# EAGLE schematic freesoc_sparkfun (EAGLE 7.1.0)

## Sheet 1 of 3
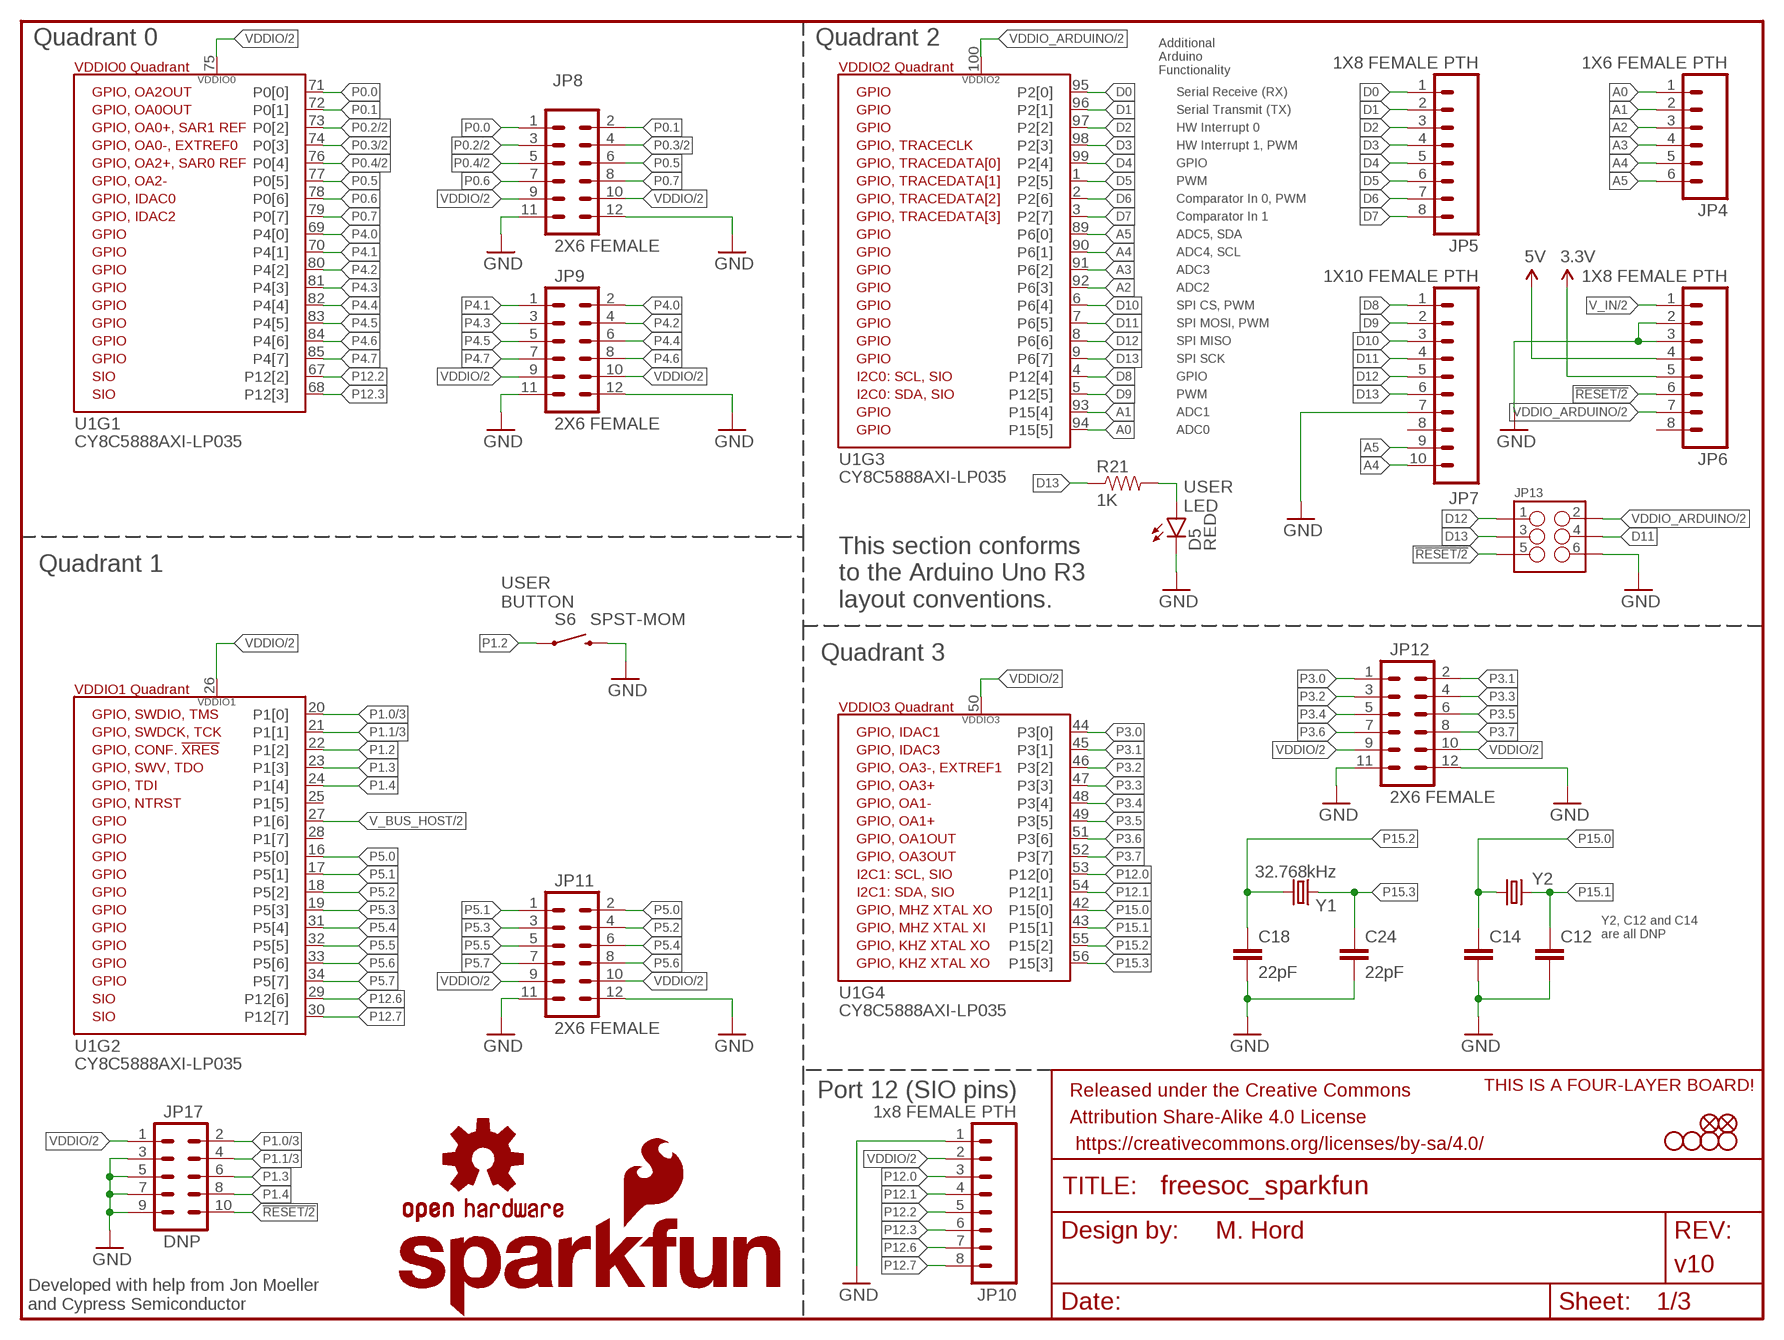
[diagram p0: schematic, sheet 1]

### Parts
C12  CAPPTH  [CAP-PTH-SMALL]
C14  CAPPTH  [CAP-PTH-SMALL]
C18  22pF  22PF-50V-5%(0603)  [0603-CAP]
C24  22pF  22PF-50V-5%(0603)  [0603-CAP]
D5  RED  LED-RED0603  [LED-0603]
FID1  FIDUCIAL1X2  [FIDUCIAL-1X2]
FID2  FIDUCIAL1X2  [FIDUCIAL-1X2]
FRAME1  FRAME-LETTER  [CREATIVE_COMMONS]
JP4  1X6 FEMALE PTH  M06SILK_FEMALE_PTH  [1X06]
JP5  1X8 FEMALE PTH  M08SILK_FEMALE_PTH  [1X08]
JP6  1X8 FEMALE PTH  M08SILK_FEMALE_PTH  [1X08]
JP7  1X10 FEMALE PTH  M10SILK_FEMALE_PTH  [1X10]
JP8  2X6 FEMALE  M06X2PTH_FEMALE  [2X6]
JP9  2X6 FEMALE  M06X2PTH_FEMALE  [2X6]
JP10  1x8 FEMALE PTH  M08SILK_FEMALE_PTH  [1X08]
JP11  2X6 FEMALE  M06X2PTH_FEMALE  [2X6]
JP12  2X6 FEMALE  M06X2PTH_FEMALE  [2X6]
JP13  M03X22X3_SILK_MALE_PTH  [2X3]
JP17  DNP  M05X20.05_IN_PTH_SILK  [2X5_PTH_SILK_.05]
LOGO1  SFE_LOGO_NAME_FLAME.2_INCH  [SFE_LOGO_NAME_FLAME_.2]
LOGO2  OSHW-LOGOS  [OSHW-LOGO-S]
R21  1K  1KOHM1/10W1%(0603)  [0603-RES]
S6  SPST-MOM  SWITCH-MOMENTARY-2SMD  [TACTILE-SWITCH-SMD]
STANDOFF1  STAND-OFF  [STAND-OFF]
STANDOFF2  STAND-OFF  [STAND-OFF]
STANDOFF3  STAND-OFF  [STAND-OFF]
STANDOFF4  STAND-OFF  [STAND-OFF]
U1  CY8C5888AXI-LP035  PSOC_5LP_100QFP  [TQFP-100-14X14MM]
U$1  FOUR_LAYER_WARNING  [FOUR_LAYER_WARNING]
Y1  32.768kHz  CRYSTALTC26H  [TC26H]
Y2  CRYSTALHC49US  [HC49US]

### Nets
3.3V: JP6.5 ; also sheet 2,3
5V: JP6.4 ; also sheet 2,3
!RESET: JP6.6 JP13.5 JP17.10 ; also sheet 2,3
A0: JP4.1 U1.94(P15[5])
A1: JP4.2 U1.93(P15[4])
A2: JP4.3 U1.92(P6[3])
A3: JP4.4 U1.91(P6[2])
A4: JP4.5 JP7.10 U1.90(P6[1])
A5: JP4.6 JP7.9 U1.89(P6[0])
D0: JP5.1 U1.95(P2[0])
D1: JP5.2 U1.96(P2[1])
D2: JP5.3 U1.97(P2[2])
D3: JP5.4 U1.98(P2[3])
D4: JP5.5 U1.99(P2[4])
D5: JP5.6 U1.1(P2[5])
D6: JP5.7 U1.2(P2[6])
D7: JP5.8 U1.3(P2[7])
D8: JP7.1 U1.4(P12[4])
D9: JP7.2 U1.5(P12[5])
D10: JP7.3 U1.6(P6[4])
D11: JP7.4 JP13.4 U1.7(P6[5])
D12: JP7.5 JP13.1 U1.8(P6[6])
D13: JP7.6 JP13.3 R21.1 U1.9(P6[7])
GND: C12.2 C14.2 C18.2 C24.2 D5.C JP6.2 JP6.3 JP7.7 JP8.11 JP8.12 JP9.11 JP9.12 JP10.1 JP11.11 JP11.12 JP12.11 JP12.12 JP13.6 JP17.3 JP17.5 JP17.7 JP17.9 S6.3 ; also sheet 2,3
N$26: D5.A R21.2
P0.0: JP8.1 U1.71(P0[0])
P0.1: JP8.2 U1.72(P0[1])
P0.2: JP8.3 U1.73(P0[2]) ; also sheet 2
P0.3: JP8.4 U1.74(P0[3]) ; also sheet 2
P0.4: JP8.5 U1.76(P0[4]) ; also sheet 2
P0.5: JP8.6 U1.77(P0[5])
P0.6: JP8.7 U1.78(P0[6])
P0.7: JP8.8 U1.79(P0[7])
P1.0: JP17.2 U1.20(P1[0]) ; also sheet 3
P1.1: JP17.4 U1.21(P1[1]) ; also sheet 3
P1.2: S6.1 U1.22(P1[2])
P1.3: JP17.6 U1.23(P1[3])
P1.4: JP17.8 U1.24(P1[4])
P3.0: JP12.1 U1.44(P3[0])
P3.1: JP12.2 U1.45(P3[1])
P3.2: JP12.3 U1.46(P3[2])
P3.3: JP12.4 U1.47(P3[3])
P3.4: JP12.5 U1.48(P3[4])
P3.5: JP12.6 U1.49(P3[5])
P3.6: JP12.7 U1.51(P3[6])
P3.7: JP12.8 U1.52(P3[7])
P4.0: JP9.2 U1.69(P4[0])
P4.1: JP9.1 U1.70(P4[1])
P4.2: JP9.4 U1.80(P4[2])
P4.3: JP9.3 U1.81(P4[3])
P4.4: JP9.6 U1.82(P4[4])
P4.5: JP9.5 U1.83(P4[5])
P4.6: JP9.8 U1.84(P4[6])
P4.7: JP9.7 U1.85(P4[7])
P5.0: JP11.2 U1.16(P5[0])
P5.1: JP11.1 U1.17(P5[1])
P5.2: JP11.4 U1.18(P5[2])
P5.3: JP11.3 U1.19(P5[3])
P5.4: JP11.6 U1.31(P5[4])
P5.5: JP11.5 U1.32(P5[5])
P5.6: JP11.8 U1.33(P5[6])
P5.7: JP11.7 U1.34(P5[7])
P12.0: JP10.3 U1.53(P12[0])
P12.1: JP10.4 U1.54(P12[1])
P12.2: JP10.5 U1.67(P12[2])
P12.3: JP10.6 U1.68(P12[3])
P12.6: JP10.7 U1.29(P12[6])
P12.7: JP10.8 U1.30(P12[7])
P15.0: C14.1 U1.42(P15[0]) Y2.1
P15.1: C12.1 U1.43(P15[1]) Y2.2
P15.2: C18.1 U1.55(P15[2]) Y1.2
P15.3: C24.1 U1.56(P15[3]) Y1.1
V_BUS_HOST: U1.27(P1[6]) ; also sheet 2
V_IN: JP6.1 ; also sheet 2
VDDIO: JP8.9 JP8.10 JP9.9 JP9.10 JP10.2 JP11.9 JP11.10 JP12.9 JP12.10 JP17.1 U1.26(VDDIO1) U1.50(VDDIO3) U1.75(VDDIO0) ; also sheet 2,3
VDDIO_ARDUINO [ARDUINO_VCC]: JP6.7 JP13.2 U1.100(VDDIO2) ; also sheet 2
Unconnected: JP6.8 JP7.8 U1.25(P1[5]) U1.28(P1[7])

### Notes on the sheet
- Quadrant 0 | Quadrant 2
- Additional
  Arduino
  Functionality
- Serial Receive (RX)
- Serial Transmit (TX)
- HW Interrupt 0
- HW Interrupt 1, PWM
- GPIO
- PWM
- Comparator In 0, PWM
- Comparator In 1
- ADC5, SDA
- ADC4, SCL
- ADC3
- ADC2
- SPI CS, PWM
- SPI MOSI, PWM
- SPI MISO
- SPI SCK
- GPIO
- PWM
- ADC1
- ADC0
- USER
  LED
- Quadrant 1
- USER
  BUTTON
- This section conforms
  to the Arduino Uno R3
  layout conventions.
- Quadrant 3
- Y2, C12 and C14
  are all DNP
- Port 12 (SIO pins)
- Developed with help from Jon Moeller
  and Cypress Semiconductor

## Sheet 2 of 3
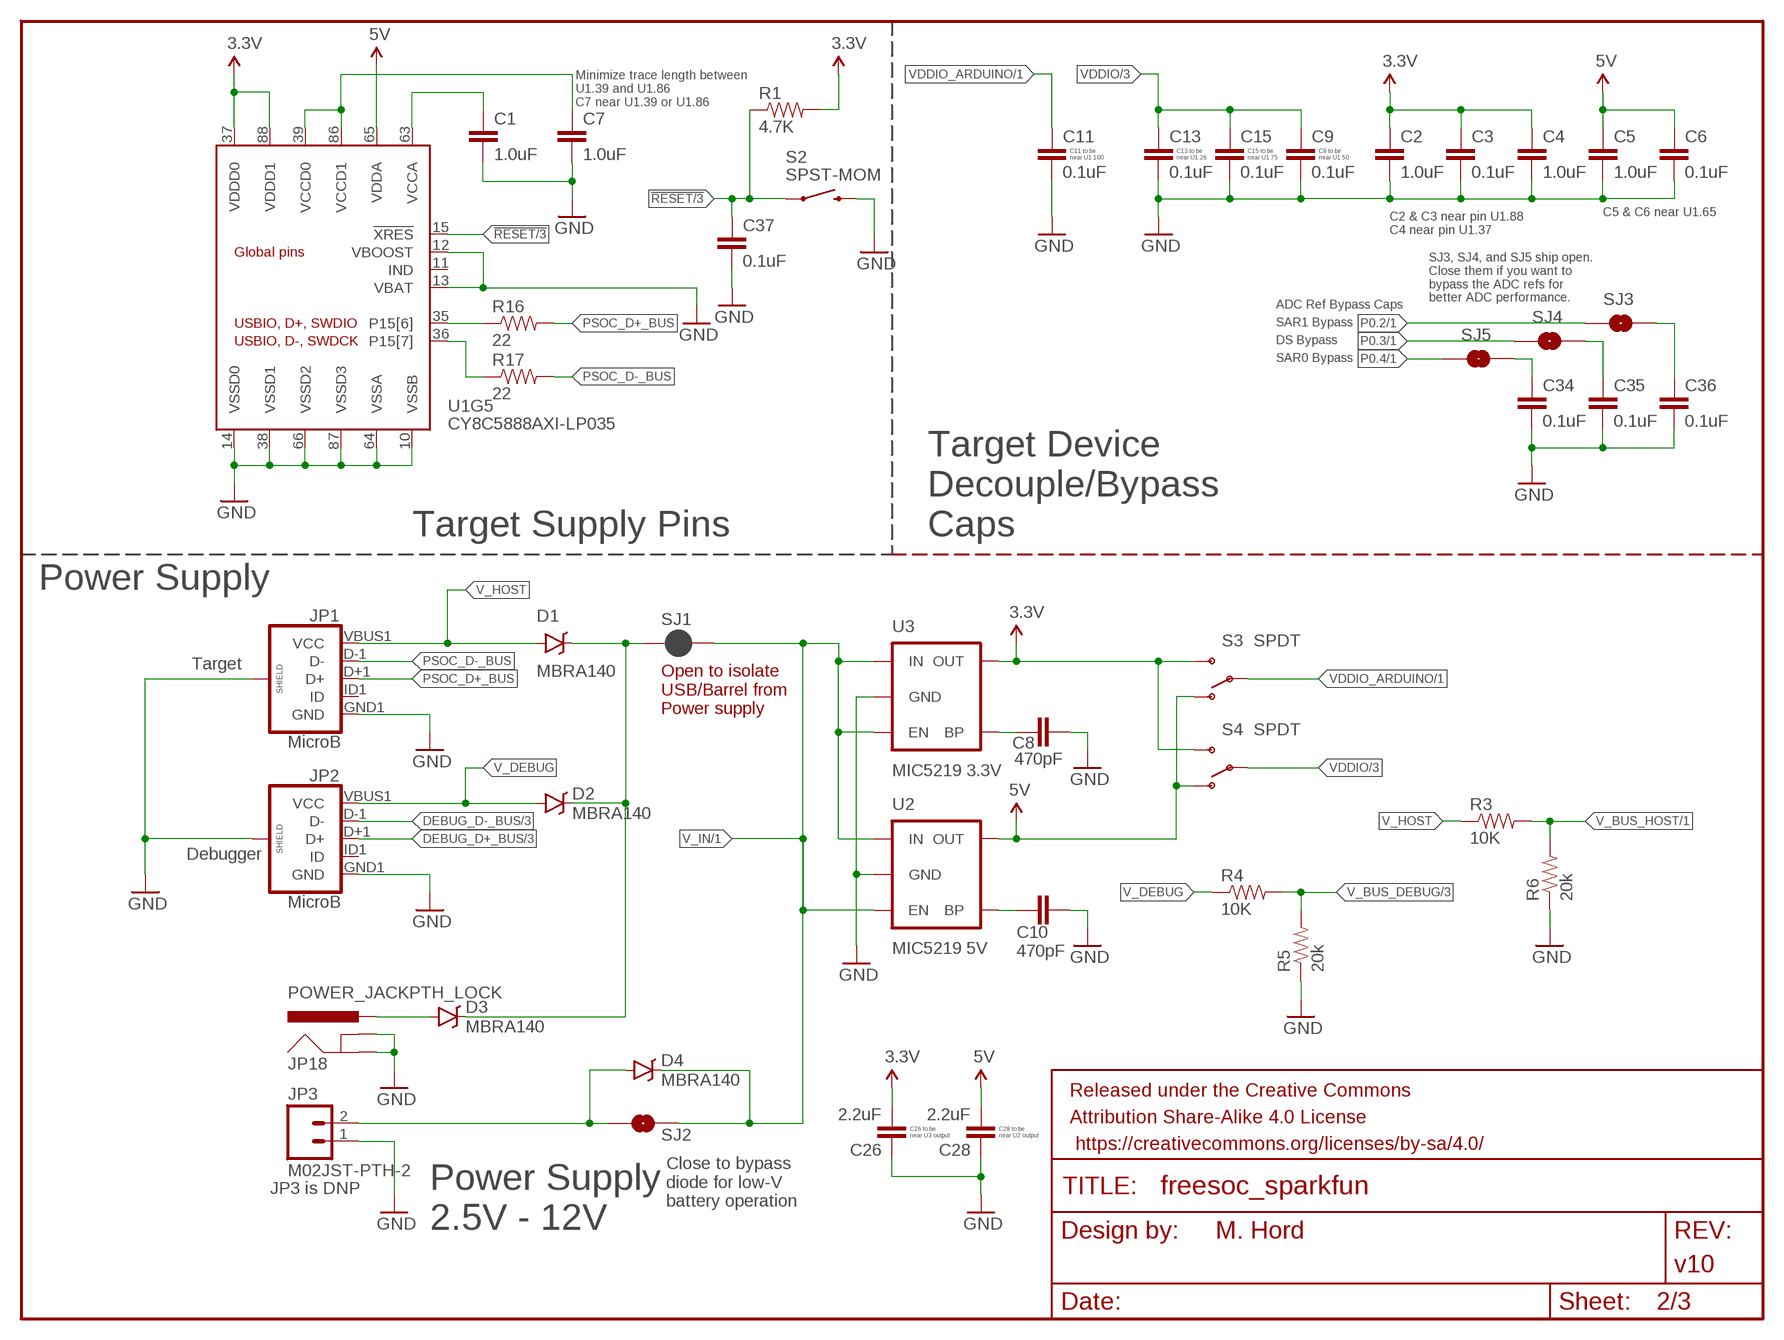
[diagram p1: schematic, sheet 2]

### Parts
C1  1.0uF  1.0UF-16V-10%(0402)  [0402-CAP]
C2  1.0uF  1.0UF-16V-10%(0402)  [0402-CAP]
C3  0.1uF  0.1UF-16V(+-10%)(0402)  [0402-CAP]
C4  1.0uF  1.0UF-16V-10%(0402)  [0402-CAP]
C5  1.0uF  1.0UF-16V-10%(0402)  [0402-CAP]
C6  0.1uF  0.1UF-16V(+-10%)(0402)  [0402-CAP]
C7  1.0uF  1.0UF-16V-10%(0402)  [0402-CAP]
C8  470pF  470PF-50V-5%(0603)SMD  [0603-CAP]
C9  0.1uF  0.1UF-16V(+-10%)(0402)  [0402-CAP]
C10  470pF  470PF-50V-5%(0603)SMD  [0603-CAP]
C11  0.1uF  0.1UF-16V(+-10%)(0402)  [0402-CAP]
C13  0.1uF  0.1UF-16V(+-10%)(0402)  [0402-CAP]
C15  0.1uF  0.1UF-16V(+-10%)(0402)  [0402-CAP]
C26  2.2uF  2.2UF-10V-20%(0603)  [0603-CAP]
C28  2.2uF  2.2UF-10V-20%(0603)  [0603-CAP]
C34  0.1uF  0.1UF-16V(+-10%)(0402)  [0402-CAP]
C35  0.1uF  0.1UF-16V(+-10%)(0402)  [0402-CAP]
C36  0.1uF  0.1UF-16V(+-10%)(0402)  [0402-CAP]
C37  0.1uF  0.1UF-16V(+-10%)(0402)  [0402-CAP]
D1  MBRA140  [SMA-DIODE]
D2  MBRA140  [SMA-DIODE]
D3  MBRA140  [SMA-DIODE]
D4  MBRA140  [SMA-DIODE]
FRAME2  FRAME-LETTER  [CREATIVE_COMMONS]
JP1  MicroB  USB_MICROB_PLUGCONN-11752  [USB-B-MICRO-SMD_V03]
JP2  MicroB  USB_MICROB_PLUGCONN-11752  [USB-B-MICRO-SMD_V03]
JP3  M02JST-PTH-2  [JST-2-PTH]
JP18  POWER_JACKPTH_LOCK  [POWER_JACK_PTH_LOCK]
R1  4.7K  4.7KOHM-1/10W-1%(0603)  [0603-RES]
R3  10K  10KOHM-1/10W-1%(0603)0603  [0603-RES]
R4  10K  10KOHM-1/10W-1%(0603)0603  [0603-RES]
R5  20k  20KOHM1/10W1%(0603)  [0603-RES]
R6  20k  20KOHM1/10W1%(0603)  [0603-RES]
R16  22  22OHM1/10W1%(0402)  [0402-RES]
R17  22  22OHM1/10W1%(0402)  [0402-RES]
S2  SPST-MOM  SWITCH-MOMENTARY-2SMD  [TACTILE-SWITCH-SMD]
S3  SPDT  SWITCH-SPDTPTH_LOCK  [SWITCH-SPDT_LOCK.007S]
S4  SPDT  SWITCH-SPDTPTH_LOCK  [SWITCH-SPDT_LOCK.007S]
SJ1  JUMPER-PAD-2-NC_BY_PASTE  [PAD-JUMPER-2-NC_BY_PASTE_YES_SILK]
SJ2  JUMPER-PAD-2-NOYES_SILK  [PAD-JUMPER-2-NO_YES_SILK]
SJ3  JUMPER-PAD-2-NO  [PAD-JUMPER-2-NO_NO_SILK]
SJ4  JUMPER-PAD-2-NO  [PAD-JUMPER-2-NO_NO_SILK]
SJ5  JUMPER-PAD-2-NO  [PAD-JUMPER-2-NO_NO_SILK]
U2  MIC5219 5V  V_REG_MIC52195V  [SOT23-5]
U3  MIC5219 3.3V  V_REG_MIC52193.3V  [SOT23-5]

### Nets
3.3V: C2.1 C3.1 C4.1 C26.2 R1.2 S3.3(S) S4.3(S) U1.37(VDDD0) U1.88(VDDD1) U3.5(OUT) ; also sheet 1,3
5V: C5.1 C6.1 C28.2 S3.1(O) S4.1(O) U1.65(VDDA) U2.5(OUT) ; also sheet 1,3
!RESET: C37.1 R1.1 S2.1 U1.15(!XRES) ; also sheet 1,3
DEBUG_D+_BUS: JP2.D+1(D+) ; also sheet 3
DEBUG_D-_BUS: JP2.D-1(D-) ; also sheet 3
GND: C1.2 C2.2 C3.2 C4.2 C5.2 C6.2 C7.2 C8.2 C9.2 C10.2 C11.2 C13.2 C15.2 C26.1 C28.1 C34.2 C35.2 C36.2 C37.2 JP1.GND1(GND) JP1.SHIELD1(SHIELD) JP1.SHIELD2(SHIELD) JP1.SHIELD3(SHIELD) JP2.GND1(GND) JP2.SHIELD1(SHIELD) JP2.SHIELD2(SHIELD) JP2.SHIELD3(SHIELD) JP3.1 JP18.GND JP18.GNDBREAK R5.1 R6.1 S2.3 U1.10(VSSB) U1.12(VBOOST) U1.13(VBAT) U1.14(VSSD0) U1.38(VSSD1) U1.64(VSSA) U1.66(VSSD2) U1.87(VSSD3) U2.2(GND) U3.2(GND) ; also sheet 1,3
N$1: C8.1 U3.4(BP)
N$2: C10.1 U2.4(BP)
N$3: C34.1 SJ5.2
N$4: C35.1 SJ4.2
N$5: C36.1 SJ3.2
N$13: D3.A JP18.PWR
N$16: D1.C D2.C D3.C SJ1.1
N$17: D4.A JP3.2 SJ2.1
P0.2: SJ3.1 ; also sheet 1
P0.3: SJ4.1 ; also sheet 1
P0.4: SJ5.1 ; also sheet 1
PSOC_D+_BUS: JP1.D+1(D+) R16.2
PSOC_D+_PAD: R16.1 U1.35(P15[6])
PSOC_D-_BUS: JP1.D-1(D-) R17.2
PSOC_D-_PAD: R17.1 U1.36(P15[7])
V_BUS_DEBUG: R4.2 R5.2 ; also sheet 3
V_BUS_HOST: R3.2 R6.2 ; also sheet 1
V_DEBUG: D2.A JP2.VBUS1(VCC) R4.1
V_HOST: D1.A JP1.VBUS1(VCC) R3.1
V_IN: D4.C SJ1.2 SJ2.2 U2.1(IN) U2.3(EN) U3.1(IN) U3.3(EN) ; also sheet 1
VCCA: C1.1 U1.63(VCCA)
VCCD: C7.1 U1.39(VCCD0) U1.86(VCCD1)
VDDIO: C9.1 C13.1 C15.1 S4.2(P) ; also sheet 1,3
VDDIO_ARDUINO [ARDUINO_VCC]: C11.1 S3.2(P) ; also sheet 1
Unconnected: JP1.ID1(ID) JP2.ID1(ID) U1.11(IND)

### Notes on the sheet
- Minimize trace length between
  U1.39 and U1.86
  C7 near U1.39 or U1.86
- C11 to be 
  near U1.100
- C13 to be 
  near U1.26
- C15 to be 
  near U1.75
- C9 to be 
  near U1.50
- C5 & C6 near U1.65
- C2 & C3 near pin U1.88
  C4 near pin U1.37
- SJ3, SJ4, and SJ5 ship open.
  Close them if you want to
  bypass the ADC refs for
  better ADC performance.
- ADC Ref Bypass Caps
- SAR1 Bypass
- DS Bypass
- SAR0 Bypass
- Target Supply Pins
- Target Device
  Decouple/Bypass
  Caps
- Power Supply
- Target
- Open to isolate
  USB/Barrel from
  Power supply
- Debugger
- C26 to be 
  near U3 output
- C28 to be 
  near U2 output
- JP3 is DNP
- Close to bypass
  diode for low-V
  battery operation
- Power Supply
  2.5V - 12V

## Sheet 3 of 3
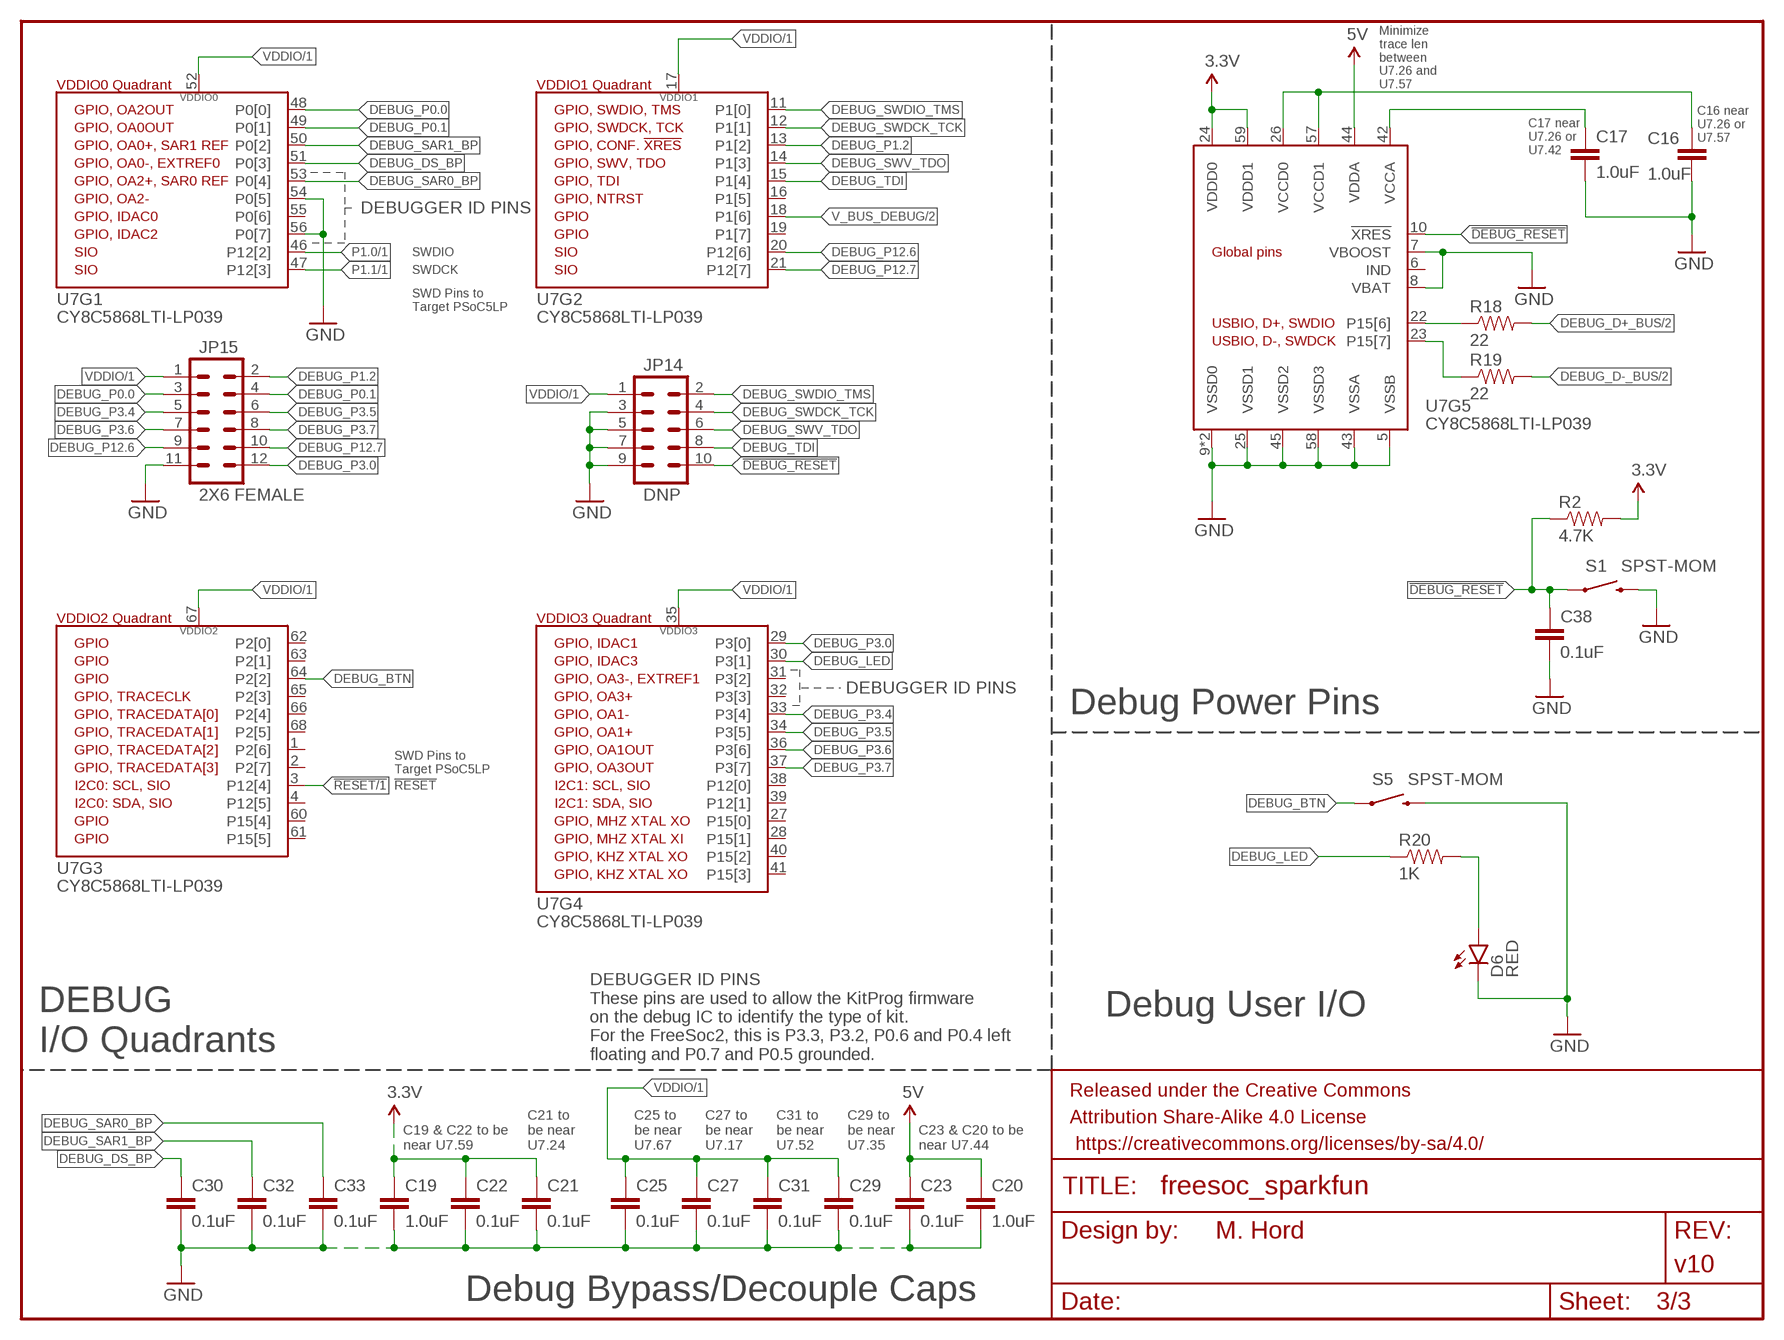
[diagram p2: schematic, sheet 3]

### Parts
C16  1.0uF  1.0UF-16V-10%(0402)  [0402-CAP]
C17  1.0uF  1.0UF-16V-10%(0402)  [0402-CAP]
C19  1.0uF  1.0UF-16V-10%(0402)  [0402-CAP]
C20  1.0uF  1.0UF-16V-10%(0402)  [0402-CAP]
C21  0.1uF  0.1UF-16V(+-10%)(0402)  [0402-CAP]
C22  0.1uF  0.1UF-16V(+-10%)(0402)  [0402-CAP]
C23  0.1uF  0.1UF-16V(+-10%)(0402)  [0402-CAP]
C25  0.1uF  0.1UF-16V(+-10%)(0402)  [0402-CAP]
C27  0.1uF  0.1UF-16V(+-10%)(0402)  [0402-CAP]
C29  0.1uF  0.1UF-16V(+-10%)(0402)  [0402-CAP]
C30  0.1uF  0.1UF-16V(+-10%)(0402)  [0402-CAP]
C31  0.1uF  0.1UF-16V(+-10%)(0402)  [0402-CAP]
C32  0.1uF  0.1UF-16V(+-10%)(0402)  [0402-CAP]
C33  0.1uF  0.1UF-16V(+-10%)(0402)  [0402-CAP]
C38  0.1uF  0.1UF-16V(+-10%)(0402)  [0402-CAP]
D6  RED  LED-RED0603  [LED-0603]
FRAME3  FRAME-LETTER  [CREATIVE_COMMONS]
JP14  DNP  M05X20.05_IN_PTH_SILK  [2X5_PTH_SILK_.05]
JP15  2X6 FEMALE  M06X2PTH_FEMALE  [2X6]
R2  4.7K  4.7KOHM-1/10W-1%(0603)  [0603-RES]
R18  22  22OHM1/10W1%(0402)  [0402-RES]
R19  22  22OHM1/10W1%(0402)  [0402-RES]
R20  1K  1KOHM1/10W1%(0603)  [0603-RES]
S1  SPST-MOM  SWITCH-MOMENTARY-2SMD  [TACTILE-SWITCH-SMD]
S5  SPST-MOM  SWITCH-MOMENTARY-2SMD  [TACTILE-SWITCH-SMD]
U7  CY8C5868LTI-LP039  PSOC_5LP_68QFN  [QFN-68]

### Nets
3.3V: C19.1 C21.1 C22.1 R2.2 U7.24(VDDD0) U7.59(VDDD1) ; also sheet 1,2
5V: C20.1 C23.1 U7.44(VDDA) ; also sheet 1,2
!DEBUG_RESET: C38.1 JP14.10 R2.1 S1.1 U7.10(!XRES)
!RESET: U7.3(P12[4]) ; also sheet 1,2
DEBUG_BTN: S5.1 U7.64(P2[2])
DEBUG_D+_BUS: R18.2 ; also sheet 2
DEBUG_D+_PAD: R18.1 U7.22(P15[6])
DEBUG_D-_BUS: R19.2 ; also sheet 2
DEBUG_D-_PAD: R19.1 U7.23(P15[7])
DEBUG_DS_BP: C30.1 U7.51(P0[3])
DEBUG_LED: R20.1 U7.30(P3[1])
DEBUG_P0.0: JP15.3 U7.48(P0[0])
DEBUG_P0.1: JP15.4 U7.49(P0[1])
DEBUG_P1.2: JP15.2 U7.13(P1[2])
DEBUG_P3.0: JP15.12 U7.29(P3[0])
DEBUG_P3.4: JP15.5 U7.33(P3[4])
DEBUG_P3.5: JP15.6 U7.34(P3[5])
DEBUG_P3.6: JP15.7 U7.36(P3[6])
DEBUG_P3.7: JP15.8 U7.37(P3[7])
DEBUG_P12.6: JP15.9 U7.20(P12[6])
DEBUG_P12.7: JP15.10 U7.21(P12[7])
DEBUG_SAR0_BP: C33.1 U7.53(P0[4])
DEBUG_SAR1_BP: C32.1 U7.50(P0[2])
DEBUG_SWDCK_TCK: JP14.4 U7.12(P1[1])
DEBUG_SWDIO_TMS: JP14.2 U7.11(P1[0])
DEBUG_SWV_TDO: JP14.6 U7.14(P1[3])
DEBUG_TDI: JP14.8 U7.15(P1[4])
GND: C16.2 C17.2 C19.2 C20.2 C21.2 C22.2 C23.2 C25.2 C27.2 C29.2 C30.2 C31.2 C32.2 C33.2 C38.2 D6.C JP14.3 JP14.5 JP14.7 JP14.9 JP15.11 S1.3 S5.3 U7.5(VSSB) U7.7(VBOOST) U7.8(VBAT) U7.9(VSSD0) U7.25(VSSD1) U7.43(VSSA) U7.45(VSSD2) U7.54(P0[5]) U7.56(P0[7]) U7.58(VSSD3) U7.69(VSSD0) ; also sheet 1,2
N$14: C16.1 U7.26(VCCD0) U7.57(VCCD1)
N$23: D6.A R20.2
N$27: C17.1 U7.42(VCCA)
P1.0: U7.46(P12[2]) ; also sheet 1
P1.1: U7.47(P12[3]) ; also sheet 1
V_BUS_DEBUG: U7.18(P1[6]) ; also sheet 2
VDDIO: C25.1 C27.1 C29.1 C31.1 JP14.1 JP15.1 U7.17(VDDIO1) U7.35(VDDIO3) U7.52(VDDIO0) U7.67(VDDIO2) ; also sheet 1,2
Unconnected: U7.1(P2[6]) U7.2(P2[7]) U7.4(P12[5]) U7.6(IND) U7.16(P1[5]) U7.19(P1[7]) U7.27(P15[0]) U7.28(P15[1]) U7.31(P3[2]) U7.32(P3[3]) U7.38(P12[0]) U7.39(P12[1]) U7.40(P15[2]) U7.41(P15[3]) U7.55(P0[6]) U7.60(P15[4]) U7.61(P15[5]) U7.62(P2[0]) U7.63(P2[1]) U7.65(P2[3]) U7.66(P2[4]) U7.68(P2[5])

### Notes on the sheet
- Minimize
  trace len
  between
  U7.26 and
  U7.57
- C16 near 
  U7.26 or
  U7.57
- C17 near 
  U7.26 or
  U7.42
- DEBUGGER ID PINS
- SWDIO
- SWDCK
- SWD Pins to 
  Target PSoC5LP
- DEBUGGER ID PINS
- Debug Power Pins
- SWD Pins to 
  Target PSoC5LP
- !RESET
- DEBUGGER ID PINS
  These pins are used to allow the KitProg firmware
  on the debug IC to identify the type of kit. 
  For the FreeSoc2, this is P3.3, P3.2, P0.6 and P0.4 left
  floating and P0.7 and P0.5 grounded.
- Debug User I/O
- DEBUG
  I/O Quadrants
- C19 & C22 to be
  near U7.59
- C21 to
  be near
  U7.24
- C25 to
  be near
  U7.67
- C27 to
  be near
  U7.17
- C31 to
  be near
  U7.52
- C29 to
  be near
  U7.35
- C23 & C20 to be
  near U7.44
- Debug Bypass/Decouple Caps

## Library data of the parts
C1 C2 C4 C5 C7 C16 C17 C19 C20 = SparkFun-Capacitors:1.0UF-16V-10%(0402); PROD_ID: CAP-12417
C3 C6 C9 C11 C13 C15 C21-C23 C25 C27 C29-C38 = SparkFun-Capacitors:0.1UF-16V(+-10%)(0402); PROD_ID: CAP-12416
C8 C10 = SparkFun-Capacitors:470PF-50V-5%(0603): CAP-07884; PROD_ID: CAP-07884
C12 C14 = SparkFun-Capacitors:CAP: Capacitor Standard 0603 ceramic capacitor, and 0.1" leaded capacitor.
C18 C24 = SparkFun-Capacitors:22PF-50V-5%(0603): CAP-07876; PROD_ID: CAP-07876
C26 C28 = SparkFun-Capacitors:2.2UF-10V-20%(0603): CAP-07888; PROD_ID: CAP-07888
D1-D4 = SparkFun-DiscreteSemi:MBRA140: 40V, 1A Schottky rectifier SMA/DO-214AC package DIO-08053; PROD_ID: DIO-08053
D5 D6 = SparkFun-LED:LED-RED: Assorted Red LEDs LilyPad 1206- DIO-09912 1206- DIO-00809 0603- DIO-00819; PROD_ID: DIO-00819
FID1 FID2 = SparkFun-Aesthetics:FIDUCIAL: Fiducial Alignment Points Various fiducial points for machine vision alignment.
FRAME1-FRAME3 = SparkFun-Aesthetics:FRAME-LETTER: Schematic Frame Standard 8.5x11 US Letter frame; DESIGNER: M. Hord; VERSION: v10
JP1 JP2 = SparkFun-Connectors:USB_MICROB_PLUG: USB Micro-B connectors Some male, some female. Watch your step!; PROD_ID: CONN-11752
JP3 = SparkFun-Connectors:M02: Standard 2-pin 0.1" header. Use with - straight break away headers ( PRT-00116) - right angle break away headers (PRT-00553) - swiss pins (PRT-00743) - machine pins (PRT-00117) - female headers (PRT-00115) Molex polarized connector foot print use with: PRT-08233 with associated crimp pins and housings. 2.54_SCREWTERM for use with PRT-10571. 3.5mm Screw Terminal footprints for PRT-08084 5mm Screw Terminal footprints for use with PRT-08432; PROD_ID: CONN-09863; SKU: PRT-09914
JP4 = SparkFun-Connectors:M06: Header 6 Standard 6-pin 0.1" header. Use with straight break away headers (SKU : PRT-00116), right angle break away headers (PRT-00553), swiss pins (PRT-00743), machine pins (PRT-00117), and female headers (PRT-00115). Molex polarized connector foot print use with SKU : PRT-08094 with associated crimp pins and housings. NOTES ON THE VARIANTS LOCK and LOCK_LONGPADS... This footprint was designed to help hold the alignment of a through-hole component (i.e. 6-pin header) while soldering it into place. You may notice that each hole has been shifted either up or down by 0.005 of an inch from it's more standard position (which is a perfectly straight line). This slight alteration caused the pins (the squares in the middle) to touch the edges of the holes. Because they are alternating, it causes a "brace" to hold the component in place. 0.005 has proven to be the perfect amount of "off-center" position when using our standard breakaway headers. Although looks a little odd when you look at the bare footprint, once you have a header in there, the alteration is very hard to notice. Also,if you push a header all the way into place, it is covered up entirely on the bottom side. This idea of altering the position of holes to aid alignment will be further integrated into the Sparkfun Library for other footprints. It can help hold any component with 3 or more connection pins.; PROD_ID: CONN-08437
JP5 JP6 JP10 = SparkFun-Connectors:M08: Header 8 Standard 8-pin 0.1" header. Use with straight break away headers (SKU : PRT-00116), right angle break away headers (PRT-00553), swiss pins (PRT-00743), machine pins (PRT-00117), and female headers (PRT-00115).; PROD_ID: CONN-08438
JP7 = SparkFun-Connectors:M10: Header 10 Standard 10-pin 0.1" header. Use with straight break away headers (SKU : PRT-00116), right angle break away headers (PRT-00553), swiss pins (PRT-00743), machine pins (PRT-00117), and female headers (PRT-00115).; PROD_ID: CONN-11563
JP8 JP9 JP11 JP12 JP15 = SparkFun-Connectors:M06X2; PROD_ID: CONN-12423
JP13 = SparkFun-Connectors:M03X2: 2x3 .1" header. Shrouded, with keying- CONN-10681 SMT- CONN-11415 Pogo pins- HW-11044; PROD_ID: CONN-09701
JP14 JP17 = SparkFun-Connectors:M05X2: Header 5x2 Standard 10-pin dual row 0.1" header. Commonly used with AVR-ISP. Use with Spark Fun Electronics SKU: PRT-00778
JP18 = SparkFun-Connectors:POWER_JACK: Power Jack This is the standard 5.5mm barrel jack for power. The PTH is the most common, proven, reliable, footprint. The Slot footprint only works if the mill layer is transmitted to the PCB fab house so be warned. Mating wall wart : TOL-00298 (and others); PROD_ID: CONN-08197; SF_ID: PRT-00119
LOGO1 = SparkFun-Aesthetics:SFE_LOGO_NAME_FLAME: SFE Logo, name and flame This is the SparkFun full logo. The logo on the schematic will always be the same size; the package variant is the height of the flame part of the logo. Default layer for the logo on the board is tSilk.
LOGO2 = SparkFun-Aesthetics:OSHW-LOGO: Open Source Hardware Logo This logo indicates the piece of hardware it is found on incorporates a OSHW license and/or adheres to the definition of open source hardware found here: http://freedomdefined.org/OSHW
R1 R2 = SparkFun-Resistors:4.7KOHM-1/10W-1%(0603): RES-07857; PROD_ID: RES-07857
R3 R4 = SparkFun-Resistors:10KOHM-1/10W-1%(0603): RES-00824; PROD_ID: RES-00824
R5 R6 = SparkFun-Resistors:20KOHM1/10W1%(0603): RES-09383; PROD_ID: RES-09383
R16-R19 = SparkFun-Resistors:22OHM1/10W1%(0402); PROD_ID: RES-12427
R20 R21 = SparkFun-Resistors:1KOHM1/10W1%(0603): RES-07856; PROD_ID: RES-07856
S1 S2 S5 S6 = SparkFun-Electromechanical:SWITCH-MOMENTARY-2: Various NO switches- pushbuttons, reed, etc; PROD_ID: SWCH-08247
S3 S4 = SparkFun-Electromechanical:SWITCH-SPDT: SPDT Switch Simple slide switch, Spark Fun Electronics SKU : COM-00102 DPDT SMT slide switch, AYZ0202, SWCH-08179
SJ1 = SparkFun-Passives:JUMPER-PAD-2-NC_BY_PASTE
SJ2-SJ5 = SparkFun-Passives:JUMPER-PAD-2-NO
STANDOFF1-STANDOFF4 = SparkFun-Electromechanical:STAND-OFF: #4 Stand Off This is the mechanical footprint for a #4 phillips button head screw. Use the keepout ring to avoid running the screw head into surrounding components. SKU : PRT-00447
U1 = SparkFun-DigitalIC:PSOC_5LP_100QFP: Cypress PSOC 5LP, 100-pin package We use the CY8C5868AXI-LP035, which has the "full" feature set: - 256k flash - 64k SRAM - 2k EEPROM - CAN - Full-speed USB - 67MHz operation; PROD_ID: IC-12190; VALUE: CY8C5868AXI-LP035
U2 = SparkFun-PowerIC:V_REG_MIC5219: V_REG MIC5219 Standard 3.3V and 5V 500mA LDO voltage regulator in SOT-23 layout. Micrel part MIC5219. BP (by-pass) pin is used to lower output noise with 470pF cap, may be left open.; PROD_ID: VREG-10107
U3 = SparkFun-PowerIC:V_REG_MIC5219: V_REG MIC5219 Standard 3.3V and 5V 500mA LDO voltage regulator in SOT-23 layout. Micrel part MIC5219. BP (by-pass) pin is used to lower output noise with 470pF cap, may be left open.; PROD_ID: VREG-09872
U7 = SparkFun-DigitalIC:PSOC_5LP_68QFN: PSoC5LP 68-QFN package; PROD_ID: IC-12391
U$1 = SparkFun-Aesthetics:FOUR_LAYER_WARNING: Warning text which will appear on both the schematic and the board file, notifying viewers that the design is a four-layer PCB.
Y1 = SparkFun-FreqCtrl:CRYSTAL: Various standard crystals. Proven footprints.; PROD_ID: XTAL-10112
Y2 = SparkFun-FreqCtrl:CRYSTAL: Various standard crystals. Proven footprints.

## Net classes
0 signal: width 0.203 mm, drill 0.254 mm, clearance 0.152 mm
1 AVCC: width 0.508 mm, drill 0.508 mm, clearance 0.152 mm
2 ARDUINO_VCC: width 0.508 mm, drill 0.381 mm